# Altium project StepStick.PrjPcb
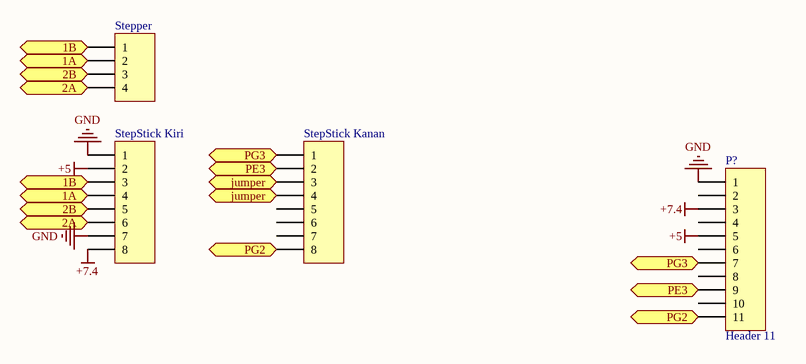
[diagram p0: StepStick-2.SchDoc]
1 sheet, 4 parts. Net scope: flat (ports and power ports of the same name join across sheets).
Board file: StepStick-2.PcbDoc

## Sheet StepStick-2.SchDoc
size A4

### Parts
G_7_5_D_S_E  Header 11  [HDR1X11]
Stepper  (no value)  [My_1X04]
StepStick_Kanan  (no value)  [HDR1X8]
StepStick_Kiri  (no value)  [HDR1X8]

### Ports
1A (in), 1A (out), 1B (in), 1B (out), 2A (in), 2A (out), 2B (in), 2B (out), jumper (in), jumper (out), PE3 (in), PE3 (out), PG2 (in), PG2 (out), PG3 (in), PG3 (out)

### Nets
+5: G_7_5_D_S_E.5 StepStick_Kiri.2
+7.4: G_7_5_D_S_E.3 StepStick_Kiri.8
GND: G_7_5_D_S_E.1 StepStick_Kiri.1 StepStick_Kiri.7
NetG_7_5_D_S_E_7: G_7_5_D_S_E.7 StepStick_Kanan.1 ; port PG3
NetG_7_5_D_S_E_9: G_7_5_D_S_E.9 StepStick_Kanan.2 ; port PE3
NetG_7_5_D_S_E_11: G_7_5_D_S_E.11 StepStick_Kanan.8 ; port PG2
NetStepper_1: Stepper.1 StepStick_Kiri.3 ; port 1B
NetStepper_2: Stepper.2 StepStick_Kiri.4 ; port 1A
NetStepper_3: Stepper.3 StepStick_Kiri.5 ; port 2B
NetStepper_4: Stepper.4 StepStick_Kiri.6 ; port 2A
NetStepStick_Kanan_3: StepStick_Kanan.3 StepStick_Kanan.4 ; port jumper

Not connected (* = marked no-connect by the designer): G_7_5_D_S_E 2 4 6 8 10; StepStick_Kanan 5 6 7

### Library data of the parts
G_7_5_D_S_E = Header 11: Header, 11-Pin
Stepper = Header 4: Header, 4-Pin; LatestRevisionDate: 17-Jul-2002; LatestRevisionNote: Re-released for DXP Platform.; Publisher: Altium Limited
StepStick_Kanan StepStick_Kiri = Header 8: Header, 8-Pin; LatestRevisionDate: 17-Jul-2002; LatestRevisionNote: Re-released for DXP Platform.; Publisher: Altium Limited